# Altium project PCB_Project.PrjPcb
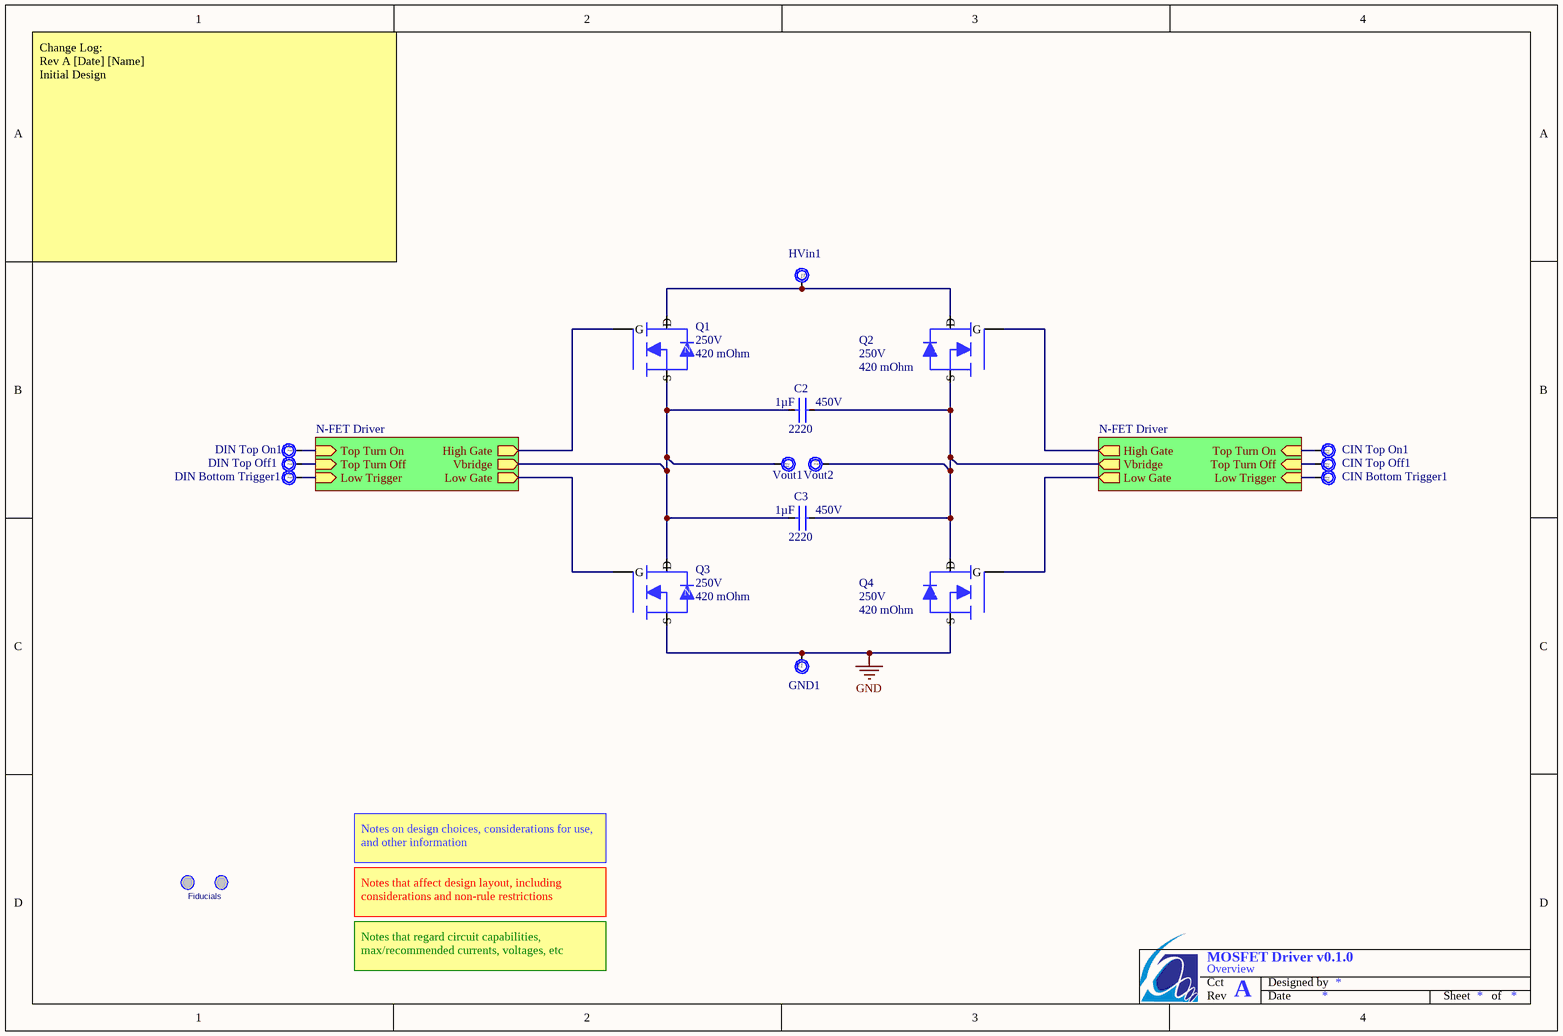
[diagram p0: Overview.SchDoc]
SolderMaskColour: Green; SilkScreenColour: White; ProjectTitle: MOSFET Driver; ProjectRevision: v0.1.0; ProcessType: Lead Free; NumberOfLayers: 2; Material: 94V-0; Finish: ENIG; DateFinished: Still being worked on; DateCode: mmddy; Company: Price Electronics
4 sheets, 62 parts. Net scope: hierarchical (ports join the sheet entries above them; power ports are global).
Board file: H-Bridge v0.1.0.PCBDOC
Sheets:
  Overview.SchDoc
    N-FET Driver = N-FET Driver.SchDoc
      High-Side Driver = High-Side Driver.SchDoc
      High-Side Driver = High-Side Driver.SchDoc
      High-Side Driver = High-Side Driver.SchDoc
      Low-Side Driver = Low-Side Driver.SchDoc
    N-FET Driver = N-FET Driver.SchDoc
      High-Side Driver = High-Side Driver.SchDoc
      High-Side Driver = High-Side Driver.SchDoc
      High-Side Driver = High-Side Driver.SchDoc
      Low-Side Driver = Low-Side Driver.SchDoc

## Sheet Overview.SchDoc: Overview
size A4; Revision: A

### Parts
C2  Capacitance: 1µF  Voltage - Rated: 450V  Package / Case: 2220  [C2220 - Ceramic]  (hidden comment: 1uF 2220 450V)
C3  Capacitance: 1µF  Voltage - Rated: 450V  Package / Case: 2220  [C2220 - Ceramic]  (hidden comment: 1uF 2220 450V)
CIN_Bottom_Trigger1  Test Point  [Test Pad Large]  (value not drawn)  (no BOM)
CIN_Top_Off1  Test Point  [Test Pad Large]  (value not drawn)  (no BOM)
CIN_Top_On1  Test Point  [Test Pad Large]  (value not drawn)  (no BOM)
DIN_Bottom_Trigger1  Test Point  [Test Pad Large]  (value not drawn)  (no BOM)
DIN_Top_Off1  Test Point  [Test Pad Large]  (value not drawn)  (no BOM)
DIN_Top_On1  Test Point  [Test Pad Large]  (value not drawn)  (no BOM)
FD1  Fiducials  [Fiducial - Top Only]
FD2  Fiducial, Top Only  [Fiducial - Top Only]  (value not drawn)
GND1  Test Point  [Test Pad Large]  (value not drawn)  (no BOM)
HVin1  Test Point  [Test Pad Large]  (value not drawn)  (no BOM)
Q1  Drain to Source Voltage (Vdss): 250V  Rds On (Max) @ Id, Vgs: 420 mOhm  [DPAK]  (hidden comment: N-MOSFET 420mR 250V)
Q2  Drain to Source Voltage (Vdss): 250V  Rds On (Max) @ Id, Vgs: 420 mOhm  [DPAK]  (hidden comment: N-MOSFET 420mR 250V)
Q3  Drain to Source Voltage (Vdss): 250V  Rds On (Max) @ Id, Vgs: 420 mOhm  [DPAK]  (hidden comment: N-MOSFET 420mR 250V)
Q4  Drain to Source Voltage (Vdss): 250V  Rds On (Max) @ Id, Vgs: 420 mOhm  [DPAK]  (hidden comment: N-MOSFET 420mR 250V)
Vout1  Test Point  [Test Pad Large]  (value not drawn)  (no BOM)
Vout2  Test Point  [Test Pad Large]  (value not drawn)  (no BOM)

### Sub-sheets
N-FET Driver = N-FET Driver.SchDoc: Top Turn On (in), Top Turn Off (in), Low Trigger (in), High Gate (out), Vbridge (out), Low Gate (out)
N-FET Driver = N-FET Driver.SchDoc: Top Turn On (in), Top Turn Off (in), Low Trigger (in), High Gate (out), Vbridge (out), Low Gate (out)

### Nets
GND: GND1.1 Q3.3(S) Q4.3(S)
Low Trigger: CIN_Bottom_Trigger1.1 ; sheet N-FET Driver/Low Trigger
Low Trigger: DIN_Bottom_Trigger1.1 ; sheet N-FET Driver/Low Trigger  [a separate net that carries the same name]
Top Turn Off: CIN_Top_Off1.1 ; sheet N-FET Driver/Top Turn Off
Top Turn Off: DIN_Top_Off1.1 ; sheet N-FET Driver/Top Turn Off  [a separate net that carries the same name]
Top Turn On: CIN_Top_On1.1 ; sheet N-FET Driver/Top Turn On
Top Turn On: DIN_Top_On1.1 ; sheet N-FET Driver/Top Turn On  [a separate net that carries the same name]
Vbridge: C2.1 C3.1 Q1.3(S) Q3.2(D) Vout1.1 ; sheet N-FET Driver/Vbridge
Vbridge: C2.2 C3.2 Q2.3(S) Q4.2(D) Vout2.1 ; sheet N-FET Driver/Vbridge  [a separate net that carries the same name]
NetD2A_2: Q2.1(G) ; sheet N-FET Driver/High Gate
NetD2B_2: Q1.1(G) ; sheet N-FET Driver/High Gate
NetHVin1_1: HVin1.1 Q1.2(D) Q2.2(D)
NetQ3_1: Q3.1(G) ; sheet N-FET Driver/Low Gate
NetQ4_1: Q4.1(G) ; sheet N-FET Driver/Low Gate

### Notes on the sheet
- Change Log:
  Rev A	[Date]	[Name]
  Initial Design
- Notes on design choices, considerations for use, and other information
- Notes that affect design layout, including considerations and non-rule restrictions
- Notes that regard circuit capabilities, max/recommended currents, voltages, etc
- Cct
- Designed by
- Rev
- Date
- Sheet       of
- (in symbol N-MOSFET 420mR 250V) N
- (in symbol Test Point) Test; Point

### Library data of the parts
C2 C3 = 1uF 2220 450V: Manufacturer: TDK Corporation; Manufacturer Part Number: CGA9P4X7T2W105M250KE; Tolerance: ±20%; Temperature Coefficient: X7T; Supplier 1: Digi-Key; Supplier Part Number 1: 445-7998-1-ND; RoHS: RoHS Compliant; Category: Capacitors; Stock 1: 10247; Pricing 1: 1=3.11, 10=2.576, 100=2.1589, 250=1.78012 (USD); Packaging: Cut Tape (CT); Part Status: Active; Operating Temperature: -55°C ~ 125°C; Features: Soft Termination; Ratings: AEC-Q200; Applications: Automotive, Boardflex Sensitive; Failure Rate: -; Mounting Type: Surface Mount, MLCC; Size / Dimension: 0.224" L x 0.197" W (5.70mm x 5.00mm); Height - Seated (Max): -; Thickness (Max): 0.098" (2.50mm); Lead Spacing: -; Lead Style: -; ComponentLink1URL: https://product.tdk.com/info/en/catalog/datasheets/mlcc_automotive_soft_en.pdf; ComponentLink1Description: Spec Sheet; Value: 1uF 2220 450V
FD1 = Fiducial, Top Only: Technology: Mechanical
Q1-Q4 = N-MOSFET 420mR 250V: Manufacturer: Fairchild/ON Semiconductor; Manufacturer Part Number: FQD9N25TM; FET Type: N-Channel; Current - Continuous Drain (Id) @ 25°C: 7.4A (Tc); Drive Voltage (Max Rds On,  Min Rds On): 10V; Vgs(th) (Max) @ Id: 5V @ 250µA; Gate Charge (Qg) (Max) @ Vgs: 20nC @ 10V; Input Capacitance (Ciss) (Max) @ Vds: 700pF @ 25V; Vgs (Max): ±30V; Power Dissipation (Max): 2.5W (Ta), 55W (Tc); Supplier 1: Digi-Key; Supplier Part Number 1: FQD9N25TMCT-ND; RoHS: RoHS Compliant; Category: Discrete Semiconductor Products; Stock 1: 4941; Pricing 1: 1=0.86, 10=0.766, 100=0.597, 500=0.49316, 1000=0.38934 (USD); Packaging: Cut Tape (CT); Part Status: Active; Technology: MOSFET (Metal Oxide); FET Feature: -; Operating Temperature: -55°C ~ 150°C (TJ); Mounting Type: Surface Mount; Supplier Device Package: D-Pak; Package / Case: TO-252-3, DPak (2 Leads + Tab), SC-63; ComponentLink1URL: https://www.fairchildsemi.com/datasheets/FQ/FQD9N25.pdf; ComponentLink1Description: Spec Sheet
FD2 = Fiducial, Top Only: Technology: Mechanical

## Sheet N-FET Driver.SchDoc
size A4
Used 2 times, as channels N-FET Driver, N-FET Driver. Parts and nets are listed once, with the designators drawn on the sheet.
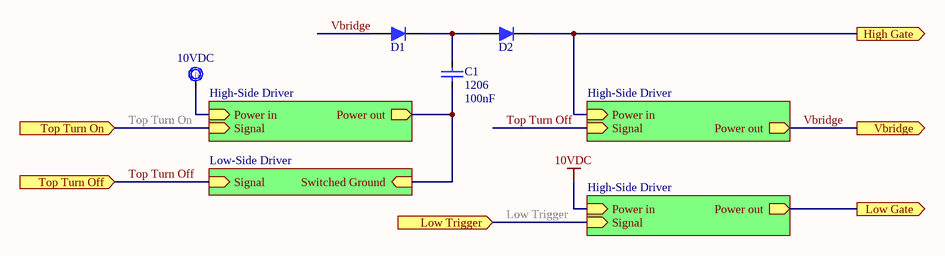
[diagram p1: N-FET Driver.SchDoc]

### Parts
10VDC  Test Point  [Test Pad Large]  (value not drawn)  (no BOM)
C1  1206  Capacitance: 100nF  [Capacitor - 1206 Ceramic]
D1  Diode - Signal 1A  [SMA - Diode]  (value not drawn)
D2  Diode - Signal 1A  [SMA - Diode]  (value not drawn)

### Sub-sheets
High-Side Driver = High-Side Driver.SchDoc: Signal (in), Power out (out), Power in (in)
High-Side Driver = High-Side Driver.SchDoc: Signal (in), Power out (out), Power in (in)
High-Side Driver = High-Side Driver.SchDoc: Signal (in), Power out (out), Power in (in)
Low-Side Driver = Low-Side Driver.SchDoc: Signal (in), Switched Ground (in)

### Ports
High Gate (out), Low Gate (out), Low Trigger (in), Top Turn Off (in), Top Turn On (in), Vbridge (out)

### Nets
High Gate: D2.2(Cathode) ; port High Gate, sheet High-Side Driver/Power in
Low Gate: port Low Gate, sheet High-Side Driver/Power out
Low Trigger: port Low Trigger, sheet High-Side Driver/Signal
Top Turn Off: port Top Turn Off, sheet High-Side Driver/Signal, sheet Low-Side Driver/Signal
Top Turn On: port Top Turn On, sheet High-Side Driver/Signal
Vbridge: D1.1(Anode) ; port Vbridge, sheet High-Side Driver/Power out
Net10VDC_1: 10VDC.1 ; sheet High-Side Driver/Power in
NetC1_1: C1.1 D1.2(Cathode) D2.1(Anode)
NetC1_2: C1.2 ; sheet High-Side Driver/Power out, sheet Low-Side Driver/Switched Ground

### Channels
N-FET Driver: designators end in B; ports High Gate=NetD2B_2 Low Gate=NetQ3_1 Low Trigger=Low Trigger Top Turn Off=Top Turn Off Top Turn On=Top Turn On Vbridge=Vbridge
N-FET Driver: designators end in A; ports High Gate=NetD2A_2 Low Gate=NetQ4_1 Low Trigger=Low Trigger Top Turn Off=Top Turn Off Top Turn On=Top Turn On Vbridge=Vbridge

### Notes on the sheet
- Change Log:
  Rev A	[Date]	[Name]
  Initial Design
- Notes on design choices, considerations for use, and other information
- Notes that affect design layout, including considerations and non-rule restrictions
- Notes that regard circuit capabilities, max/recommended currents, voltages, etc
- Cct
- Designed by
- Rev
- Date
- Sheet       of
- (in symbol Test Point) Point; Test

### Library data of the parts
C1 = 100nF 1206 50V: Non-polarized; Manufacturer: Kemet; Manufacturer Part Number: C1206C104K5RAC7867; Value: 100 nF 50V 1206 X7R 10%; Tolerance: ±10%; Voltage - Rated: 50V; Temperature Coefficient: X7R; Price P/N: 020101-001; Technology: SMT; Supplier 1: Digi-Key; RoHS: RoHS Compliant; Category: Capacitors; Stock 1: 910232; Pricing 1: 1=0.13, 10=0.095, 25=0.068, 50=0.052, 100=0.044, 250=0.036, 1000=0.02351 (CAD); Packaging: Cut Tape (CT); Mounting Type: Surface Mount, MLCC; Operating Temperature: -55°C ~ 125°C; Applications: General Purpose; Ratings: -; Package / Case: 1206 (3216 Metric); Size / Dimension: 0.126" L x 0.063" W (3.20mm x 1.60mm); Height - Seated (Max): -; Thickness (Max): 0.035" (0.88mm); Lead Spacing: -; Features: -; Lead Style: -; ComponentLink1URL: http://www.kemet.com/docfinder?Partnumber=C1206C104K5RACTU; ComponentLink1Description: Spec Sheet; Supplier Part Number 1: 399-1249-1-ND
D1 D2 = Diode - Signal 1A: Signal Diode; Manufacturer: Fairchild Semiconductor; Manufacturer Part Number: RS1M; Diode Type: Standard; Voltage - DC Reverse (Vr) (Max): 1000V (1kV); Voltage - Forward (Vf) (Max) @ If: 1.3V @ 1A; Speed: Fast Recovery =< 500ns, > 200mA (Io); Reverse Recovery Time (trr): 500ns; Current - Reverse Leakage @ Vr: 5µA @ 1000V; Capacitance @ Vr, F: 10pF @ 4V, 1MHz; Price P/N: 020107-002; Technology: SMT; Value: Signal Diode; Supplier 1: Digi-Key; Supplier Part Number 1: RS1MFSCT-ND; RoHS: RoHS Compliant; Category: Discrete Semiconductor Products; Stock 1: 3125; Pricing 1: 1=0.47, 10=0.339, 25=0.2632, 100=0.1993, 250=0.14092, 500=0.11282, 1000=0.08654, 2500=0.07522 (CAD); Packaging: Cut Tape (CT); Current - Average Rectified (Io): 1A; Mounting Type: Surface Mount; Package / Case: DO-214AC, SMA; Supplier Device Package: SMA (DO-214AC); Operating Temperature - Junction: -55°C ~ 150°C; ComponentLink1URL: http://www.fairchildsemi.com/datasheets/RS/RS1M.pdf; ComponentLink1Description: Spec Sheet

## Sheet High-Side Driver.SchDoc: High-Side Driver
size A4; Date: 2014-10-14; DocumentNumber: 23; Revision: A; SheetNumber: 23; SheetTotal: 43; DesignedBy: Craig Comberbach
Used 6 times, as channels N-FET Driver/High-Side Driver, N-FET Driver/High-Side Driver, N-FET Driver/High-Side Driver, N-FET Driver/High-Side Driver, N-FET Driver/High-Side Driver, N-FET Driver/High-Side Driver. Parts and nets are listed once, with the designators drawn on the sheet.
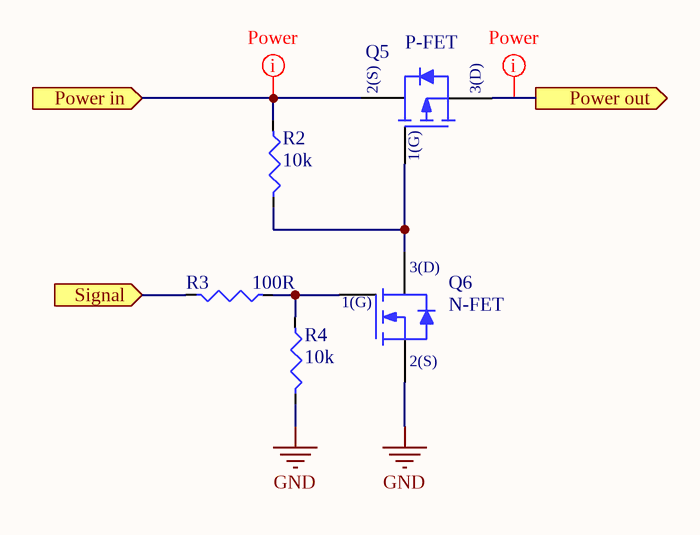
[diagram p2: High-Side Driver.SchDoc]

### Parts
Q5  P-FET  [SOT23 - 3 pin]
Q6  N-FET  [SOT23 - 3 pin]
R2  Resistance (Ohms): 10k  [Resistor - 1206]
R3  Resistance (Ohms): 100R  [Resistor - 1206]  (hidden comment: 2k 1206 5%)
R4  Resistance (Ohms): 10k  [Resistor - 1206]

### Ports
Power in (in), Power out (out), Signal (in)

### Nets
GND: Q6.2(Source) R4.2
Power in: Q5.2(Source) R2.1 ; port Power in
Power out: Q5.3(Drain) ; port Power out
Signal: R3.1 ; port Signal
NetQ5_1: Q5.1(Gate) Q6.3(Drain) R2.2
NetQ6_1: Q6.1(Gate) R3.2 R4.1

### Channels
N-FET Driver/High-Side Driver: designators end in F; ports Power in=Net10VDCB_1 Power out=NetC1B_2 Signal=Top Turn On
N-FET Driver/High-Side Driver: designators end in E; ports Power in=NetD2B_2 Power out=Vbridge Signal=Top Turn Off
N-FET Driver/High-Side Driver: designators end in D; ports Power in=10VDC Power out=NetQ3_1 Signal=Low Trigger
N-FET Driver/High-Side Driver: designators end in C; ports Power in=Net10VDCA_1 Power out=NetC1A_2 Signal=Top Turn On
N-FET Driver/High-Side Driver: designators end in B; ports Power in=NetD2A_2 Power out=Vbridge Signal=Top Turn Off
N-FET Driver/High-Side Driver: designators end in A; ports Power in=10VDC Power out=NetQ4_1 Signal=Low Trigger

### Layout directives
net class Power: Net10VDCB_1, NetC1B_2

### Notes on the sheet
- Cct
- Designed by
- Rev
- Date
- Sheet       of
- (in symbol N Channel MOSFET) 3(D); 1(G); 2(S)
- (in symbol P Channel MOSFET 3.5A) 2(S); 3(D); 1(G)

### Library data of the parts
Q5 = P Channel MOSFET 3.5A: P Channel MOSFET; Manufacturer: Diodes Incorporated; Manufacturer Part Number: DMP3130L-7; FET Type: MOSFET P-Channel, Metal Oxide; FET Feature: Logic Level Gate; Drain to Source Voltage (Vdss): 30V; Current - Continuous Drain (Id) @ 25°C: 3.5A (Ta); Rds On (Max) @ Id, Vgs: 77 mOhm @ 4.2A, 10V; Vgs(th) (Max) @ Id: 1.3V @ 250µA; Gate Charge (Qg) @ Vgs: 12nC @ 10V; Input Capacitance (Ciss) @ Vds: 432pF @ 15V; Power - Max: 1.4W; Price P/N: 020166-006; Technology: SMT; Value: P Channel MOSFET; Supplier 1: Digi-Key; Supplier Part Number 1: DMP3130LDICT-ND; RoHS: RoHS Compliant; Category: Discrete Semiconductor Products; Stock 1: 76890; Pricing 1: 1=0.57, 10=0.444, 25=0.3736, 100=0.3047, 250=0.2524, 500=0.20848, 1000=0.15615 (CAD); Packaging: Cut Tape (CT); Mounting Type: Surface Mount; Package / Case: TO-236-3, SC-59, SOT-23-3; Supplier Device Package: SOT-23-3; ComponentLink1URL: http://www.diodes.com/datasheets/ds31524.pdf; ComponentLink1Description: Spec Sheet
Q6 = N Channel MOSFET: Manufacturer: NXP Semiconductors; Manufacturer Part Number: 2N7002,215; QuickValue: 2N7002; FET Type: MOSFET N-Channel, Metal Oxide; FET Feature: Logic Level Gate; Drain to Source Voltage (Vdss): 60V; Current - Continuous Drain (Id) @ 25°C: 300mA (Ta); Rds On (Max) @ Id, Vgs: 5 Ohm @ 500mA, 10V; Vgs(th) (Max) @ Id: 2.5V @ 250µA; Input Capacitance (Ciss) @ Vds: 50pF @ 10V; Power - Max: 830mW; Price P/N: 020166-005; Technology: SMT; Value: N Channel MOSFET; Supplier 1: Digi-Key; Supplier Part Number 1: 568-1369-1-ND; RoHS: RoHS Compliant; Category: Discrete Semiconductor Products; Stock 1: 765228; Pricing 1: 1=0.18, 10=0.167, 25=0.1512, 100=0.109, 250=0.06416, 500=0.05324, 1000=0.03632 (CAD); Packaging: Cut Tape (CT); Gate Charge (Qg) @ Vgs: -; Mounting Type: Surface Mount; Package / Case: TO-236-3, SC-59, SOT-23-3; Supplier Device Package: SOT-23 (TO-236AB); ComponentLink1URL: http://www.nxp.com/documents/data_sheet/2N7002.pdf; ComponentLink1Description: Spec Sheet
R2 R4 = 10k 1206 1%: Resistor; Manufacturer: Vishay Dale; Manufacturer Part Number: CRCW120610K0FKEA; Tolerance: ±1%; Power (Watts): 0.25W, 1/4W; Temperature Coefficient: ±100ppm/°C; Price P/N: 020100-004; Technology: SMT; Value: 10k 1206 1%; Supplier 1: Digi-Key; Supplier Part Number 1: 541-10.0KFCT-ND; RoHS: RoHS Compliant; Category: Resistors; Stock 1: 393912; Pricing 1: 10=0.131, 50=0.0704, 200=0.0404, 1000=0.02755 (CAD); Packaging: Cut Tape (CT); Composition: Thick Film; Features: Automotive AEC-Q200 Qualified; Package / Case: 1206 (3216 Metric); Supplier Device Package: 1206 (3216 Metric); Size / Dimension: 0.126" L x 0.063" W (3.20mm x 1.60mm); Height: 0.024" (0.60mm); Number of Terminations: 2; ComponentLink1URL: http://www.vishay.com/docs/20035/dcrcwe3.pdf; ComponentLink1Description: Spec Sheet
R3 = 2k 1206 5%: Resistor; Manufacturer: Yageo; Manufacturer Part Number: RC1206FR-07100RL; Description: RES SMD 100 OHM 1% 1/4W 1206; Tolerance: ±1%; Power (Watts): 0.25W, 1/4W; Temperature Coefficient: ±100ppm/°C; Technology: SMT; Value: 2k 1206 5%; Supplier 1: Digi-Key; Supplier Part Number 1: 311-100FRCT-ND; RoHS: RoHS Compliant; Category: Resistors; Stock 1: 1567506; Pricing 1: 1=0.15, 10=0.044, 25=0.032, 50=0.0242, 100=0.0178, 250=0.0136, 500=0.01088, 1000=0.00801 (CAD); Packaging: Cut Tape (CT); Part Status: Active; Composition: Thick Film; Features: Moisture Resistant; Operating Temperature: -55°C ~ 155°C; Package / Case: 1206 (3216 Metric); Supplier Device Package: 1206; Size / Dimension: 0.122" L x 0.063" W (3.10mm x 1.60mm); Height - Seated (Max): 0.026" (0.65mm); Failure Rate: -; ComponentLink1URL: http://www.yageo.com/documents/recent/PYu-RC_Group_51_RoHS_L_6.pdf; ComponentLink1Description: http://www.yageo.com/documents/recent/PYu-RC_Group_51_RoHS_L_6.pdf

## Sheet Low-Side Driver.SchDoc: Low-Side Driver
size A4; Date: 2014-10-07; CompanyName: Price Industries; DocumentNumber: 25; Revision: A; SheetNumber: 25; SheetTotal: 43; DesignedBy: Craig Comberbach
Used 2 times, as channels N-FET Driver/Low-Side Driver, N-FET Driver/Low-Side Driver. Parts and nets are listed once, with the designators drawn on the sheet.
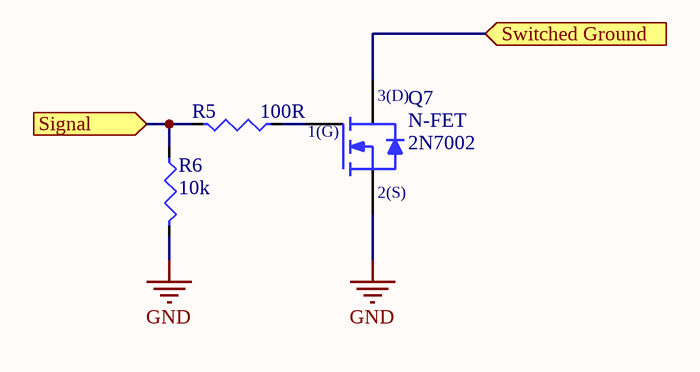
[diagram p3: Low-Side Driver.SchDoc]

### Parts
Q7  N-FET  QuickValue: 2N7002  [SOT23 - 3 pin]
R5  Resistance (Ohms): 100R  [Resistor - 1206]  (hidden comment: 2k 1206 5%)
R6  Resistance (Ohms): 10k  [Resistor - 1206]

### Ports
Signal (in), Switched Ground (in)

### Nets
GND: Q7.2(Source) R6.2
Signal: R5.1 R6.1 ; port Signal
Switched Ground: Q7.3(Drain) ; port Switched Ground
NetQ7_1: Q7.1(Gate) R5.2

### Channels
N-FET Driver/Low-Side Driver: designators end in B; ports Signal=Top Turn Off Switched Ground=NetC1B_2
N-FET Driver/Low-Side Driver: designators end in A; ports Signal=Top Turn Off Switched Ground=NetC1A_2

### Notes on the sheet
- (in symbol N Channel MOSFET) 3(D); 1(G); 2(S)

### Library data of the parts
Q7 = N Channel MOSFET: Manufacturer: NXP Semiconductors; Manufacturer Part Number: 2N7002,215; FET Type: MOSFET N-Channel, Metal Oxide; FET Feature: Logic Level Gate; Drain to Source Voltage (Vdss): 60V; Current - Continuous Drain (Id) @ 25°C: 300mA (Ta); Rds On (Max) @ Id, Vgs: 5 Ohm @ 500mA, 10V; Vgs(th) (Max) @ Id: 2.5V @ 250µA; Input Capacitance (Ciss) @ Vds: 50pF @ 10V; Power - Max: 830mW; Price P/N: 020166-005; Technology: SMT; Value: N Channel MOSFET; Supplier 1: Digi-Key; Supplier Part Number 1: 568-1369-1-ND; RoHS: RoHS Compliant; Category: Discrete Semiconductor Products; Stock 1: 765228; Pricing 1: 1=0.18, 10=0.167, 25=0.1512, 100=0.109, 250=0.06416, 500=0.05324, 1000=0.03632 (CAD); Packaging: Cut Tape (CT); Gate Charge (Qg) @ Vgs: -; Mounting Type: Surface Mount; Package / Case: TO-236-3, SC-59, SOT-23-3; Supplier Device Package: SOT-23 (TO-236AB); ComponentLink1URL: http://www.nxp.com/documents/data_sheet/2N7002.pdf; ComponentLink1Description: Spec Sheet
R5 = 2k 1206 5%: Resistor; Manufacturer: Yageo; Manufacturer Part Number: RC1206FR-07100RL; Tolerance: ±1%; Power (Watts): 0.25W, 1/4W; Temperature Coefficient: ±100ppm/°C; Technology: SMT; Value: 2k 1206 5%; Supplier 1: Digi-Key; Supplier Part Number 1: 311-100FRCT-ND; RoHS: RoHS Compliant; Category: Resistors; Stock 1: 1567506; Pricing 1: 1=0.15, 10=0.044, 25=0.032, 50=0.0242, 100=0.0178, 250=0.0136, 500=0.01088, 1000=0.00801 (CAD); Packaging: Cut Tape (CT); Part Status: Active; Composition: Thick Film; Features: Moisture Resistant; Operating Temperature: -55°C ~ 155°C; Package / Case: 1206 (3216 Metric); Supplier Device Package: 1206; Size / Dimension: 0.122" L x 0.063" W (3.10mm x 1.60mm); Height - Seated (Max): 0.026" (0.65mm); Failure Rate: -; ComponentLink1URL: http://www.yageo.com/documents/recent/PYu-RC_Group_51_RoHS_L_6.pdf; ComponentLink1Description: http://www.yageo.com/documents/recent/PYu-RC_Group_51_RoHS_L_6.pdf
R6 = 10k 1206 1%: as R2 on sheet High-Side Driver; Price P/N: 020100-004; Technology: SMT; Value: 10k 1206 1%; Supplier 1: Digi-Key; Supplier Part Number 1: 541-10.0KFCT-ND; RoHS: RoHS Compliant; Category: Resistors; Stock 1: 393912; Pricing 1: 10=0.131, 50=0.0704, 200=0.0404, 1000=0.02755 (CAD); Packaging: Cut Tape (CT); Composition: Thick Film; Features: Automotive AEC-Q200 Qualified; Package / Case: 1206 (3216 Metric); Supplier Device Package: 1206 (3216 Metric); Size / Dimension: 0.126" L x 0.063" W (3.20mm x 1.60mm); Height: 0.024" (0.60mm); Number of Terminations: 2; ComponentLink1URL: http://www.vishay.com/docs/20035/dcrcwe3.pdf; ComponentLink1Description: Spec Sheet

## Nets that join several sheets
10VDC: N-FET Driver/High-Side Driver (Q5D.2 R2D.1), N-FET Driver/High-Side Driver (Q5A.2 R2A.1)
GND: Overview (GND1.1 Q3.3 Q4.3), N-FET Driver/High-Side Driver (Q6F.2 R4F.2), N-FET Driver/High-Side Driver (Q6E.2 R4E.2), N-FET Driver/High-Side Driver (Q6D.2 R4D.2), N-FET Driver/Low-Side Driver (Q7B.2 R6B.2), N-FET Driver/High-Side Driver (Q6C.2 R4C.2), N-FET Driver/High-Side Driver (Q6B.2 R4B.2), N-FET Driver/High-Side Driver (Q6A.2 R4A.2), N-FET Driver/Low-Side Driver (Q7A.2 R6A.2)
Low Trigger: Overview (CIN_Bottom_Trigger1.1), N-FET Driver/High-Side Driver (R3A.1)
Low Trigger: Overview (DIN_Bottom_Trigger1.1), N-FET Driver/High-Side Driver (R3D.1)
Net10VDCA_1: N-FET Driver (10VDCA.1), N-FET Driver/High-Side Driver (Q5C.2 R2C.1)
Net10VDCB_1: N-FET Driver (10VDCB.1), N-FET Driver/High-Side Driver (Q5F.2 R2F.1)
NetC1A_2: N-FET Driver (C1A.2), N-FET Driver/High-Side Driver (Q5C.3), N-FET Driver/Low-Side Driver (Q7A.3)
NetC1B_2: N-FET Driver (C1B.2), N-FET Driver/High-Side Driver (Q5F.3), N-FET Driver/Low-Side Driver (Q7B.3)
NetD2A_2: Overview (Q2.1), N-FET Driver (D2A.2), N-FET Driver/High-Side Driver (Q5B.2 R2B.1)
NetD2B_2: Overview (Q1.1), N-FET Driver (D2B.2), N-FET Driver/High-Side Driver (Q5E.2 R2E.1)
NetQ3_1: Overview (Q3.1), N-FET Driver/High-Side Driver (Q5D.3)
NetQ4_1: Overview (Q4.1), N-FET Driver/High-Side Driver (Q5A.3)
Top Turn Off: Overview (CIN_Top_Off1.1), N-FET Driver/High-Side Driver (R3B.1), N-FET Driver/Low-Side Driver (R5A.1 R6A.1)
Top Turn Off: Overview (DIN_Top_Off1.1), N-FET Driver/High-Side Driver (R3E.1), N-FET Driver/Low-Side Driver (R5B.1 R6B.1)
Top Turn On: Overview (CIN_Top_On1.1), N-FET Driver/High-Side Driver (R3C.1)
Top Turn On: Overview (DIN_Top_On1.1), N-FET Driver/High-Side Driver (R3F.1)
Vbridge: Overview (5 pins), N-FET Driver (D1B.1), N-FET Driver/High-Side Driver (Q5E.3)
Vbridge: Overview (5 pins), N-FET Driver (D1A.1), N-FET Driver/High-Side Driver (Q5B.3)